# Altium schematic sheet DigitDriver.SCHDOC
size A4; DocumentNumber: 4; SheetNumber: 4; SheetTotal: 6
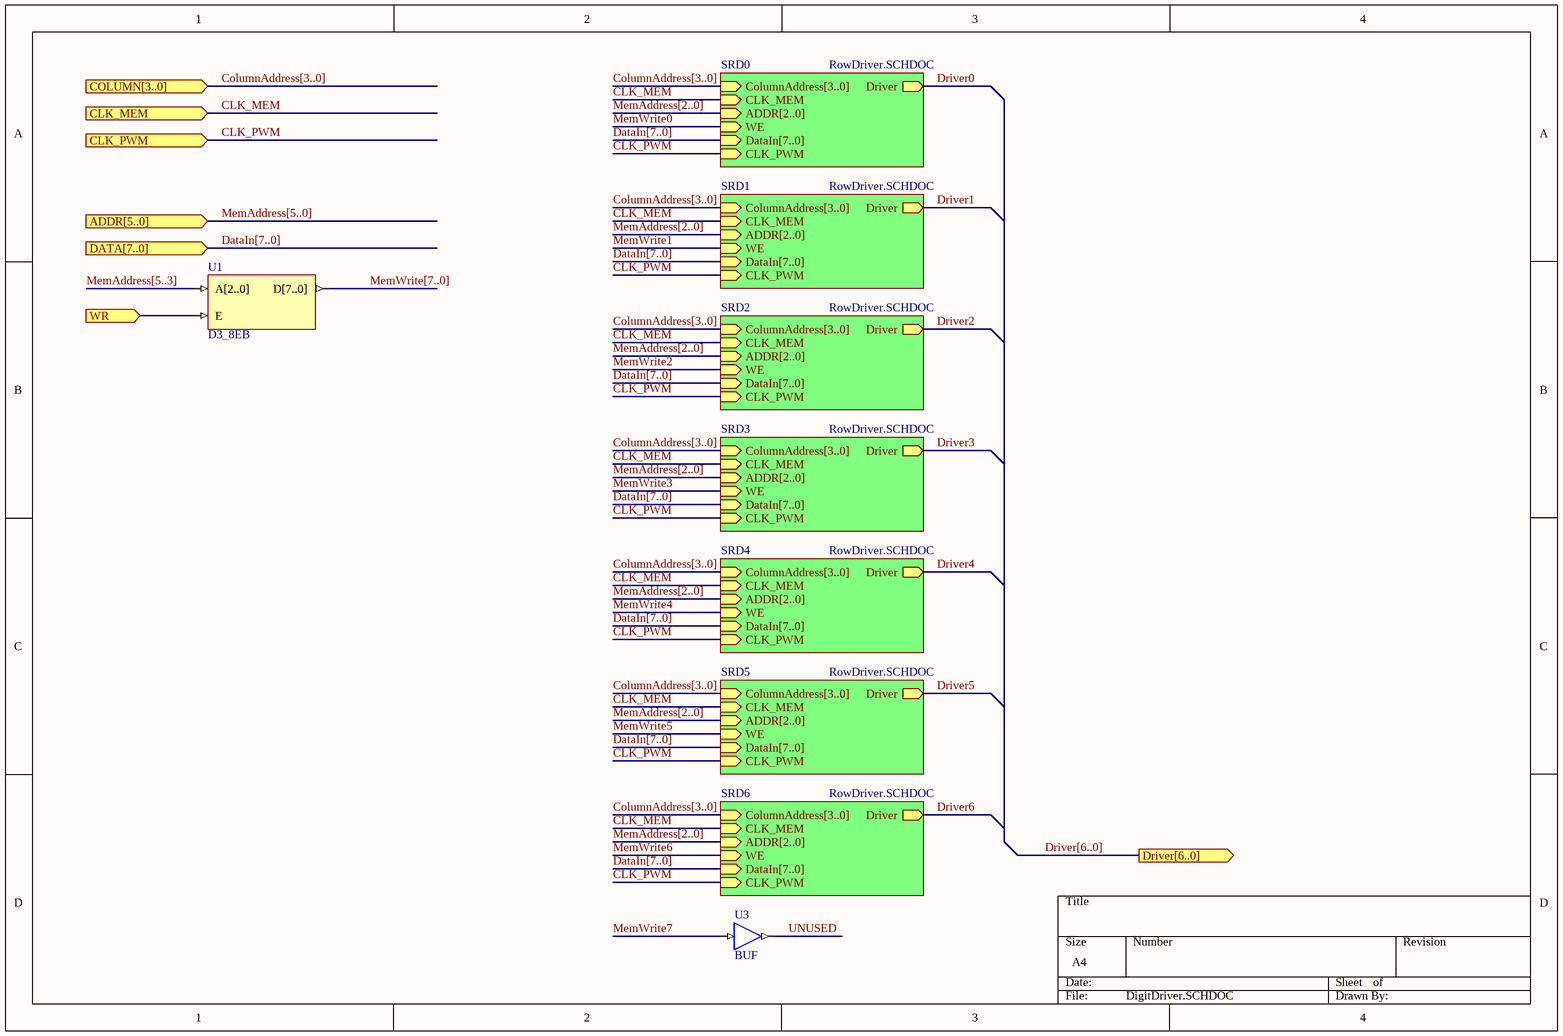
[diagram p0: DigitDriver.SCHDOC]

## Parts
U1  D3_8EB
U3  BUF

## Sub-sheets
SRD0 = RowDriver.SCHDOC: ColumnAddress[3..0] (in), CLK_MEM (in), ADDR[2..0] (in), WE (in), DataIn[7..0] (in), Driver (out), CLK_PWM (in)
SRD1 = RowDriver.SCHDOC: ColumnAddress[3..0] (in), CLK_MEM (in), ADDR[2..0] (in), WE (in), DataIn[7..0] (in), Driver (out), CLK_PWM (in)
SRD2 = RowDriver.SCHDOC: ColumnAddress[3..0] (in), CLK_MEM (in), ADDR[2..0] (in), WE (in), DataIn[7..0] (in), Driver (out), CLK_PWM (in)
SRD3 = RowDriver.SCHDOC: ColumnAddress[3..0] (in), CLK_MEM (in), ADDR[2..0] (in), WE (in), DataIn[7..0] (in), Driver (out), CLK_PWM (in)
SRD4 = RowDriver.SCHDOC: ColumnAddress[3..0] (in), CLK_MEM (in), ADDR[2..0] (in), WE (in), DataIn[7..0] (in), Driver (out), CLK_PWM (in)
SRD5 = RowDriver.SCHDOC: ColumnAddress[3..0] (in), CLK_MEM (in), ADDR[2..0] (in), WE (in), DataIn[7..0] (in), Driver (out), CLK_PWM (in)
SRD6 = RowDriver.SCHDOC: ColumnAddress[3..0] (in), CLK_MEM (in), ADDR[2..0] (in), WE (in), DataIn[7..0] (in), Driver (out), CLK_PWM (in)

## Ports
ADDR[5..0] (in), CLK_MEM (in), CLK_PWM (in), COLUMN[3..0] (in), DATA[7..0] (in), Driver[6..0] (out), WR (in)

## Nets
CLK_MEM: port CLK_MEM, sheet SRD0/CLK_MEM, sheet SRD1/CLK_MEM, sheet SRD2/CLK_MEM, sheet SRD3/CLK_MEM, sheet SRD4/CLK_MEM, sheet SRD5/CLK_MEM, sheet SRD6/CLK_MEM
CLK_PWM: port CLK_PWM, sheet SRD0/CLK_PWM, sheet SRD1/CLK_PWM, sheet SRD2/CLK_PWM, sheet SRD3/CLK_PWM, sheet SRD4/CLK_PWM, sheet SRD5/CLK_PWM, sheet SRD6/CLK_PWM
Driver0: sheet SRD0/Driver
Driver1: sheet SRD1/Driver
Driver2: sheet SRD2/Driver
Driver3: sheet SRD3/Driver
Driver4: sheet SRD4/Driver
Driver5: sheet SRD5/Driver
Driver6: sheet SRD6/Driver
MemAddress[5..3]: U1.A[2..0]
MemWrite0: sheet SRD0/WE
MemWrite1: sheet SRD1/WE
MemWrite2: sheet SRD2/WE
MemWrite3: sheet SRD3/WE
MemWrite4: sheet SRD4/WE
MemWrite5: sheet SRD5/WE
MemWrite6: sheet SRD6/WE
MemWrite7: U3.I
MemWrite[7..0]: U1.D[7..0]
UNUSED: U3.O
WR: U1.E ; port WR

## Buses and harness runs
bus ColumnAddress[3..0] = port COLUMN[3..0]
bus ColumnAddress[3..0] = sheet SRD0/ColumnAddress[3..0]
bus ColumnAddress[3..0] = sheet SRD1/ColumnAddress[3..0]
bus ColumnAddress[3..0] = sheet SRD2/ColumnAddress[3..0]
bus ColumnAddress[3..0] = sheet SRD3/ColumnAddress[3..0]
bus ColumnAddress[3..0] = sheet SRD4/ColumnAddress[3..0]
bus ColumnAddress[3..0] = sheet SRD5/ColumnAddress[3..0]
bus ColumnAddress[3..0] = sheet SRD6/ColumnAddress[3..0]
bus DataIn[7..0] = port DATA[7..0]
bus DataIn[7..0] = sheet SRD0/DataIn[7..0]
bus DataIn[7..0] = sheet SRD1/DataIn[7..0]
bus DataIn[7..0] = sheet SRD2/DataIn[7..0]
bus DataIn[7..0] = sheet SRD3/DataIn[7..0]
bus DataIn[7..0] = sheet SRD4/DataIn[7..0]
bus DataIn[7..0] = sheet SRD5/DataIn[7..0]
bus DataIn[7..0] = sheet SRD6/DataIn[7..0]
bus Driver[6..0] = port Driver[6..0]
bus MemAddress[2..0] = sheet SRD0/ADDR[2..0]
bus MemAddress[2..0] = sheet SRD1/ADDR[2..0]
bus MemAddress[2..0] = sheet SRD2/ADDR[2..0]
bus MemAddress[2..0] = sheet SRD3/ADDR[2..0]
bus MemAddress[2..0] = sheet SRD4/ADDR[2..0]
bus MemAddress[2..0] = sheet SRD5/ADDR[2..0]
bus MemAddress[2..0] = sheet SRD6/ADDR[2..0]
bus MemAddress[5..0] = port ADDR[5..0]
bus MemAddress[5..3]
bus MemWrite[7..0]

## Library data of the parts
U1 = D3_8EB: Binary 3- to 8-Bit Decoder with Enable, Bus Version; ArchiveName: GENERIC; Published: 7-Nov-2003; Publisher: Altium Limited; Core Revision: 1.00.00
U3 = BUF: 1-bit General Purpose (Non-inverting) Buffer; ArchiveName: GENERIC; Published: 7-Nov-2003; Publisher: Altium Limited; Xilinx Equivalent: BUF; Core Revision: 1.00.00